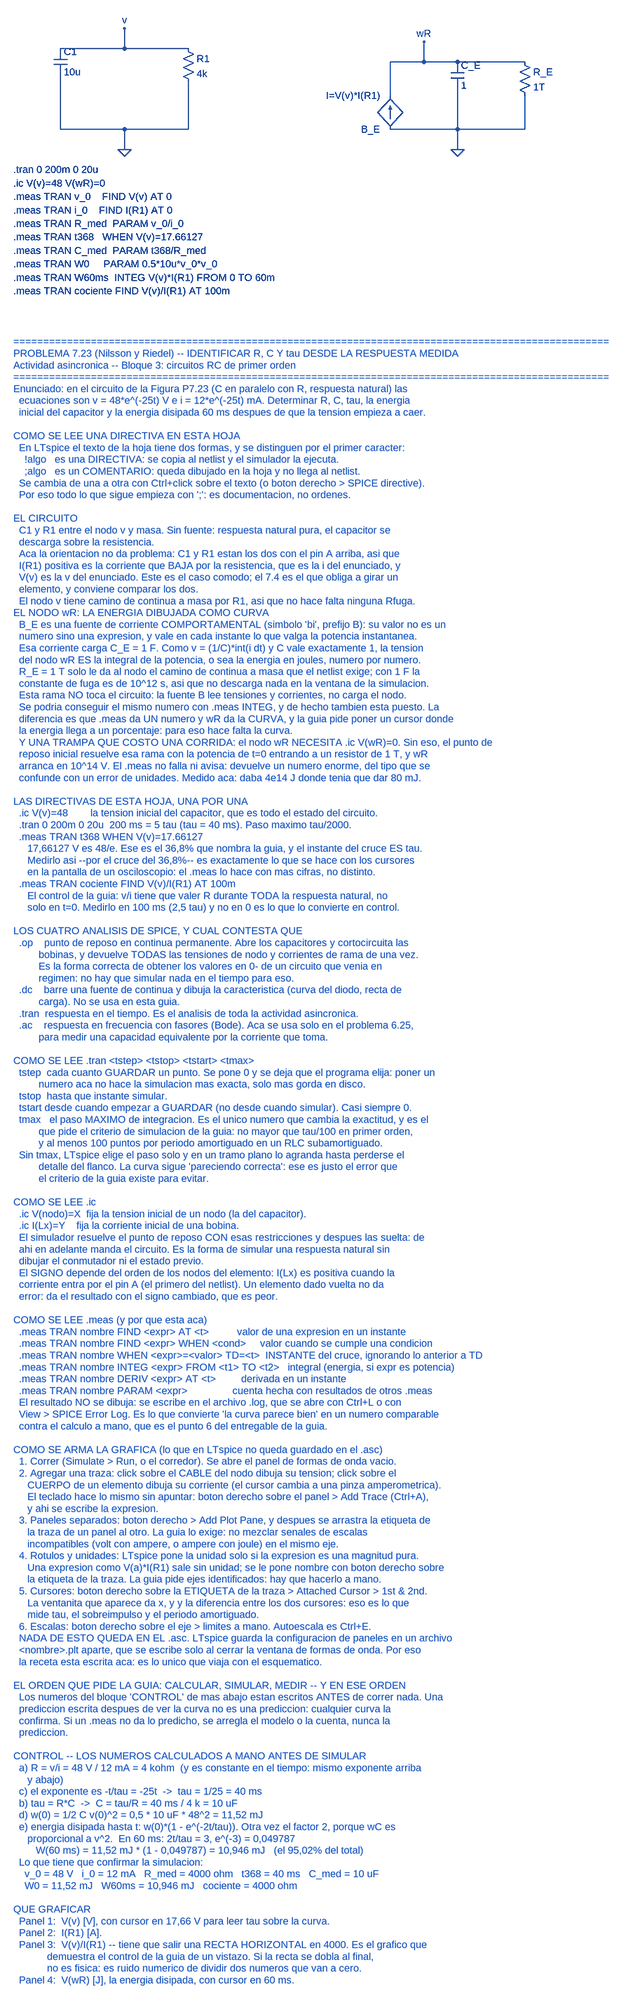
[diagram p0: schematic P7-23_RC_identificar_R_C_tau.asc]
P7-23_RC_identificar_R_C_tau.asc, the LTspice schematic file:
Version 4
SHEET 1 2200 2800
WIRE 176 176 176 304
WIRE 480 192 480 304
WIRE 176 112 480 112
WIRE 176 304 480 304
WIRE 328 304 328 352
WIRE 328 112 328 64
WIRE 960 224 960 144
WIRE 1120 208 1120 304
WIRE 1280 224 1280 304
WIRE 960 144 1280 144
WIRE 960 304 1280 304
WIRE 1120 304 1120 352
WIRE 1040 144 1040 96
FLAG 328 352 0
FLAG 328 64 v
FLAG 1120 352 0
FLAG 1040 96 wR
SYMBOL cap 160 112 R0
SYMATTR InstName C1
SYMATTR Value 10u
SYMBOL res 464 96 R0
SYMATTR InstName R1
SYMATTR Value 4k
SYMBOL bi 960 304 R180
WINDOW 123 0 0 Left 0
WINDOW 39 0 0 Left 0
SYMATTR InstName B_E
SYMATTR Value I=V(v)*I(R1)
SYMBOL cap 1104 144 R0
SYMATTR InstName C_E
SYMATTR Value 1
SYMBOL res 1264 128 R0
SYMATTR InstName R_E
SYMATTR Value 1T
TEXT 64 400 Left 2 !.tran 0 200m 0 20u
TEXT 64 432 Left 2 !.ic V(v)=48 V(wR)=0
TEXT 64 464 Left 2 !.meas TRAN v_0    FIND V(v) AT 0
TEXT 64 496 Left 2 !.meas TRAN i_0    FIND I(R1) AT 0
TEXT 64 528 Left 2 !.meas TRAN R_med  PARAM v_0/i_0
TEXT 64 560 Left 2 !.meas TRAN t368   WHEN V(v)=17.66127
TEXT 64 592 Left 2 !.meas TRAN C_med  PARAM t368/R_med
TEXT 64 624 Left 2 !.meas TRAN W0     PARAM 0.5*10u*v_0*v_0
TEXT 64 656 Left 2 !.meas TRAN W60ms  INTEG V(v)*I(R1) FROM 0 TO 60m
TEXT 64 688 Left 2 !.meas TRAN cociente FIND V(v)/I(R1) AT 100m
TEXT 64 900 Left 2 ;====================================================================================================
TEXT 64 928 Left 2 ;PROBLEMA 7.23 (Nilsson y Riedel) -- IDENTIFICAR R, C Y tau DESDE LA RESPUESTA MEDIDA
TEXT 64 956 Left 2 ;Actividad asincronica -- Bloque 3: circuitos RC de primer orden
TEXT 64 984 Left 2 ;====================================================================================================
TEXT 64 1012 Left 2 ;Enunciado: en el circuito de la Figura P7.23 (C en paralelo con R, respuesta natural) las
TEXT 64 1040 Left 2 ;  ecuaciones son v = 48*e^(-25t) V e i = 12*e^(-25t) mA. Determinar R, C, tau, la energia
TEXT 64 1068 Left 2 ;  inicial del capacitor y la energia disipada 60 ms despues de que la tension empieza a caer.
TEXT 64 1096 Left 2 ;
TEXT 64 1124 Left 2 ;COMO SE LEE UNA DIRECTIVA EN ESTA HOJA
TEXT 64 1152 Left 2 ;  En LTspice el texto de la hoja tiene dos formas, y se distinguen por el primer caracter:
TEXT 64 1180 Left 2 ;    !algo   es una DIRECTIVA: se copia al netlist y el simulador la ejecuta.
TEXT 64 1208 Left 2 ;    ;algo   es un COMENTARIO: queda dibujado en la hoja y no llega al netlist.
TEXT 64 1236 Left 2 ;  Se cambia de una a otra con Ctrl+click sobre el texto (o boton derecho > SPICE directive).
TEXT 64 1264 Left 2 ;  Por eso todo lo que sigue empieza con ';': es documentacion, no ordenes.
TEXT 64 1292 Left 2 ;
TEXT 64 1320 Left 2 ;EL CIRCUITO
TEXT 64 1348 Left 2 ;  C1 y R1 entre el nodo v y masa. Sin fuente: respuesta natural pura, el capacitor se
TEXT 64 1376 Left 2 ;  descarga sobre la resistencia.
TEXT 64 1404 Left 2 ;  Aca la orientacion no da problema: C1 y R1 estan los dos con el pin A arriba, asi que
TEXT 64 1432 Left 2 ;  I(R1) positiva es la corriente que BAJA por la resistencia, que es la i del enunciado, y
TEXT 64 1460 Left 2 ;  V(v) es la v del enunciado. Este es el caso comodo; el 7.4 es el que obliga a girar un
TEXT 64 1488 Left 2 ;  elemento, y conviene comparar los dos.
TEXT 64 1516 Left 2 ;  El nodo v tiene camino de continua a masa por R1, asi que no hace falta ninguna Rfuga.
TEXT 64 1544 Left 2 ;EL NODO wR: LA ENERGIA DIBUJADA COMO CURVA
TEXT 64 1572 Left 2 ;  B_E es una fuente de corriente COMPORTAMENTAL (simbolo 'bi', prefijo B): su valor no es un
TEXT 64 1600 Left 2 ;  numero sino una expresion, y vale en cada instante lo que valga la potencia instantanea.
TEXT 64 1628 Left 2 ;  Esa corriente carga C_E = 1 F. Como v = (1/C)*int(i dt) y C vale exactamente 1, la tension
TEXT 64 1656 Left 2 ;  del nodo wR ES la integral de la potencia, o sea la energia en joules, numero por numero.
TEXT 64 1684 Left 2 ;  R_E = 1 T solo le da al nodo el camino de continua a masa que el netlist exige; con 1 F la
TEXT 64 1712 Left 2 ;  constante de fuga es de 10^12 s, asi que no descarga nada en la ventana de la simulacion.
TEXT 64 1740 Left 2 ;  Esta rama NO toca el circuito: la fuente B lee tensiones y corrientes, no carga el nodo.
TEXT 64 1768 Left 2 ;  Se podria conseguir el mismo numero con .meas INTEG, y de hecho tambien esta puesto. La
TEXT 64 1796 Left 2 ;  diferencia es que .meas da UN numero y wR da la CURVA, y la guia pide poner un cursor donde
TEXT 64 1824 Left 2 ;  la energia llega a un porcentaje: para eso hace falta la curva.
TEXT 64 1852 Left 2 ;  Y UNA TRAMPA QUE COSTO UNA CORRIDA: el nodo wR NECESITA .ic V(wR)=0. Sin eso, el punto de
TEXT 64 1880 Left 2 ;  reposo inicial resuelve esa rama con la potencia de t=0 entrando a un resistor de 1 T, y wR
TEXT 64 1908 Left 2 ;  arranca en 10^14 V. El .meas no falla ni avisa: devuelve un numero enorme, del tipo que se
TEXT 64 1936 Left 2 ;  confunde con un error de unidades. Medido aca: daba 4e14 J donde tenia que dar 80 mJ.
TEXT 64 1964 Left 2 ;
TEXT 64 1992 Left 2 ;LAS DIRECTIVAS DE ESTA HOJA, UNA POR UNA
TEXT 64 2020 Left 2 ;  .ic V(v)=48        la tension inicial del capacitor, que es todo el estado del circuito.
TEXT 64 2048 Left 2 ;  .tran 0 200m 0 20u  200 ms = 5 tau (tau = 40 ms). Paso maximo tau/2000.
TEXT 64 2076 Left 2 ;  .meas TRAN t368 WHEN V(v)=17.66127
TEXT 64 2104 Left 2 ;     17,66127 V es 48/e. Ese es el 36,8% que nombra la guia, y el instante del cruce ES tau.
TEXT 64 2132 Left 2 ;     Medirlo asi --por el cruce del 36,8%-- es exactamente lo que se hace con los cursores
TEXT 64 2160 Left 2 ;     en la pantalla de un osciloscopio: el .meas lo hace con mas cifras, no distinto.
TEXT 64 2188 Left 2 ;  .meas TRAN cociente FIND V(v)/I(R1) AT 100m
TEXT 64 2216 Left 2 ;     El control de la guia: v/i tiene que valer R durante TODA la respuesta natural, no
TEXT 64 2244 Left 2 ;     solo en t=0. Medirlo en 100 ms (2,5 tau) y no en 0 es lo que lo convierte en control.
TEXT 64 2272 Left 2 ;
TEXT 64 2300 Left 2 ;LOS CUATRO ANALISIS DE SPICE, Y CUAL CONTESTA QUE
TEXT 64 2328 Left 2 ;  .op    punto de reposo en continua permanente. Abre los capacitores y cortocircuita las
TEXT 64 2356 Left 2 ;         bobinas, y devuelve TODAS las tensiones de nodo y corrientes de rama de una vez.
TEXT 64 2384 Left 2 ;         Es la forma correcta de obtener los valores en 0- de un circuito que venia en
TEXT 64 2412 Left 2 ;         regimen: no hay que simular nada en el tiempo para eso.
TEXT 64 2440 Left 2 ;  .dc    barre una fuente de continua y dibuja la caracteristica (curva del diodo, recta de
TEXT 64 2468 Left 2 ;         carga). No se usa en esta guia.
TEXT 64 2496 Left 2 ;  .tran  respuesta en el tiempo. Es el analisis de toda la actividad asincronica.
TEXT 64 2524 Left 2 ;  .ac    respuesta en frecuencia con fasores (Bode). Aca se usa solo en el problema 6.25,
TEXT 64 2552 Left 2 ;         para medir una capacidad equivalente por la corriente que toma.
TEXT 64 2580 Left 2 ;
TEXT 64 2608 Left 2 ;COMO SE LEE .tran <tstep> <tstop> <tstart> <tmax>
TEXT 64 2636 Left 2 ;  tstep  cada cuanto GUARDAR un punto. Se pone 0 y se deja que el programa elija: poner un
TEXT 64 2664 Left 2 ;         numero aca no hace la simulacion mas exacta, solo mas gorda en disco.
TEXT 64 2692 Left 2 ;  tstop  hasta que instante simular.
TEXT 64 2720 Left 2 ;  tstart desde cuando empezar a GUARDAR (no desde cuando simular). Casi siempre 0.
TEXT 64 2748 Left 2 ;  tmax   el paso MAXIMO de integracion. Es el unico numero que cambia la exactitud, y es el
TEXT 64 2776 Left 2 ;         que pide el criterio de simulacion de la guia: no mayor que tau/100 en primer orden,
TEXT 64 2804 Left 2 ;         y al menos 100 puntos por periodo amortiguado en un RLC subamortiguado.
TEXT 64 2832 Left 2 ;  Sin tmax, LTspice elige el paso solo y en un tramo plano lo agranda hasta perderse el
TEXT 64 2860 Left 2 ;         detalle del flanco. La curva sigue 'pareciendo correcta': ese es justo el error que
TEXT 64 2888 Left 2 ;         el criterio de la guia existe para evitar.
TEXT 64 2916 Left 2 ;
TEXT 64 2944 Left 2 ;COMO SE LEE .ic
TEXT 64 2972 Left 2 ;  .ic V(nodo)=X  fija la tension inicial de un nodo (la del capacitor).
TEXT 64 3000 Left 2 ;  .ic I(Lx)=Y    fija la corriente inicial de una bobina.
TEXT 64 3028 Left 2 ;  El simulador resuelve el punto de reposo CON esas restricciones y despues las suelta: de
TEXT 64 3056 Left 2 ;  ahi en adelante manda el circuito. Es la forma de simular una respuesta natural sin
TEXT 64 3084 Left 2 ;  dibujar el conmutador ni el estado previo.
TEXT 64 3112 Left 2 ;  El SIGNO depende del orden de los nodos del elemento: I(Lx) es positiva cuando la
TEXT 64 3140 Left 2 ;  corriente entra por el pin A (el primero del netlist). Un elemento dado vuelta no da
TEXT 64 3168 Left 2 ;  error: da el resultado con el signo cambiado, que es peor.
TEXT 64 3196 Left 2 ;
TEXT 64 3224 Left 2 ;COMO SE LEE .meas (y por que esta aca)
TEXT 64 3252 Left 2 ;  .meas TRAN nombre FIND <expr> AT <t>          valor de una expresion en un instante
TEXT 64 3280 Left 2 ;  .meas TRAN nombre FIND <expr> WHEN <cond>     valor cuando se cumple una condicion
TEXT 64 3308 Left 2 ;  .meas TRAN nombre WHEN <expr>=<valor> TD=<t>  INSTANTE del cruce, ignorando lo anterior a TD
TEXT 64 3336 Left 2 ;  .meas TRAN nombre INTEG <expr> FROM <t1> TO <t2>   integral (energia, si expr es potencia)
TEXT 64 3364 Left 2 ;  .meas TRAN nombre DERIV <expr> AT <t>         derivada en un instante
TEXT 64 3392 Left 2 ;  .meas TRAN nombre PARAM <expr>                cuenta hecha con resultados de otros .meas
TEXT 64 3420 Left 2 ;  El resultado NO se dibuja: se escribe en el archivo .log, que se abre con Ctrl+L o con
TEXT 64 3448 Left 2 ;  View > SPICE Error Log. Es lo que convierte 'la curva parece bien' en un numero comparable
TEXT 64 3476 Left 2 ;  contra el calculo a mano, que es el punto 6 del entregable de la guia.
TEXT 64 3504 Left 2 ;
TEXT 64 3532 Left 2 ;COMO SE ARMA LA GRAFICA (lo que en LTspice no queda guardado en el .asc)
TEXT 64 3560 Left 2 ;  1. Correr (Simulate > Run, o el corredor). Se abre el panel de formas de onda vacio.
TEXT 64 3588 Left 2 ;  2. Agregar una traza: click sobre el CABLE del nodo dibuja su tension; click sobre el
TEXT 64 3616 Left 2 ;     CUERPO de un elemento dibuja su corriente (el cursor cambia a una pinza amperometrica).
TEXT 64 3644 Left 2 ;     El teclado hace lo mismo sin apuntar: boton derecho sobre el panel > Add Trace (Ctrl+A),
TEXT 64 3672 Left 2 ;     y ahi se escribe la expresion.
TEXT 64 3700 Left 2 ;  3. Paneles separados: boton derecho > Add Plot Pane, y despues se arrastra la etiqueta de
TEXT 64 3728 Left 2 ;     la traza de un panel al otro. La guia lo exige: no mezclar senales de escalas
TEXT 64 3756 Left 2 ;     incompatibles (volt con ampere, o ampere con joule) en el mismo eje.
TEXT 64 3784 Left 2 ;  4. Rotulos y unidades: LTspice pone la unidad solo si la expresion es una magnitud pura.
TEXT 64 3812 Left 2 ;     Una expresion como V(a)*I(R1) sale sin unidad; se le pone nombre con boton derecho sobre
TEXT 64 3840 Left 2 ;     la etiqueta de la traza. La guia pide ejes identificados: hay que hacerlo a mano.
TEXT 64 3868 Left 2 ;  5. Cursores: boton derecho sobre la ETIQUETA de la traza > Attached Cursor > 1st & 2nd.
TEXT 64 3896 Left 2 ;     La ventanita que aparece da x, y y la diferencia entre los dos cursores: eso es lo que
TEXT 64 3924 Left 2 ;     mide tau, el sobreimpulso y el periodo amortiguado.
TEXT 64 3952 Left 2 ;  6. Escalas: boton derecho sobre el eje > limites a mano. Autoescala es Ctrl+E.
TEXT 64 3980 Left 2 ;  NADA DE ESTO QUEDA EN EL .asc. LTspice guarda la configuracion de paneles en un archivo
TEXT 64 4008 Left 2 ;  <nombre>.plt aparte, que se escribe solo al cerrar la ventana de formas de onda. Por eso
TEXT 64 4036 Left 2 ;  la receta esta escrita aca: es lo unico que viaja con el esquematico.
TEXT 64 4064 Left 2 ;
TEXT 64 4092 Left 2 ;EL ORDEN QUE PIDE LA GUIA: CALCULAR, SIMULAR, MEDIR -- Y EN ESE ORDEN
TEXT 64 4120 Left 2 ;  Los numeros del bloque 'CONTROL' de mas abajo estan escritos ANTES de correr nada. Una
TEXT 64 4148 Left 2 ;  prediccion escrita despues de ver la curva no es una prediccion: cualquier curva la
TEXT 64 4176 Left 2 ;  confirma. Si un .meas no da lo predicho, se arregla el modelo o la cuenta, nunca la
TEXT 64 4204 Left 2 ;  prediccion.
TEXT 64 4232 Left 2 ;
TEXT 64 4260 Left 2 ;CONTROL -- LOS NUMEROS CALCULADOS A MANO ANTES DE SIMULAR
TEXT 64 4288 Left 2 ;  a) R = v/i = 48 V / 12 mA = 4 kohm  (y es constante en el tiempo: mismo exponente arriba
TEXT 64 4316 Left 2 ;     y abajo)
TEXT 64 4344 Left 2 ;  c) el exponente es -t/tau = -25t  ->  tau = 1/25 = 40 ms
TEXT 64 4372 Left 2 ;  b) tau = R*C  ->  C = tau/R = 40 ms / 4 k = 10 uF
TEXT 64 4400 Left 2 ;  d) w(0) = 1/2 C v(0)^2 = 0,5 * 10 uF * 48^2 = 11,52 mJ
TEXT 64 4428 Left 2 ;  e) energia disipada hasta t: w(0)*(1 - e^(-2t/tau)). Otra vez el factor 2, porque wC es
TEXT 64 4456 Left 2 ;     proporcional a v^2.  En 60 ms: 2t/tau = 3, e^(-3) = 0,049787
TEXT 64 4484 Left 2 ;        W(60 ms) = 11,52 mJ * (1 - 0,049787) = 10,946 mJ   (el 95,02% del total)
TEXT 64 4512 Left 2 ;  Lo que tiene que confirmar la simulacion:
TEXT 64 4540 Left 2 ;    v_0 = 48 V   i_0 = 12 mA   R_med = 4000 ohm   t368 = 40 ms   C_med = 10 uF
TEXT 64 4568 Left 2 ;    W0 = 11,52 mJ   W60ms = 10,946 mJ   cociente = 4000 ohm
TEXT 64 4596 Left 2 ;
TEXT 64 4624 Left 2 ;QUE GRAFICAR
TEXT 64 4652 Left 2 ;  Panel 1:  V(v) [V], con cursor en 17,66 V para leer tau sobre la curva.
TEXT 64 4680 Left 2 ;  Panel 2:  I(R1) [A].
TEXT 64 4708 Left 2 ;  Panel 3:  V(v)/I(R1) -- tiene que salir una RECTA HORIZONTAL en 4000. Es el grafico que
TEXT 64 4736 Left 2 ;            demuestra el control de la guia de un vistazo. Si la recta se dobla al final,
TEXT 64 4764 Left 2 ;            no es fisica: es ruido numerico de dividir dos numeros que van a cero.
TEXT 64 4792 Left 2 ;  Panel 4:  V(wR) [J], la energia disipada, con cursor en 60 ms.

The netlist it stands for:
* P7-23_RC_identificar_R_C_tau.asc
C1 v 0 10u
R1 v 0 4k
B_E 0 wR I=V(v)*I(R1)
C_E wR 0 1
R_E wR 0 1T
.tran 0 200m 0 20u
.ic V(v)=48 V(wR)=0
.meas TRAN v_0    FIND V(v) AT 0
.meas TRAN i_0    FIND I(R1) AT 0
.meas TRAN R_med  PARAM v_0/i_0
.meas TRAN t368   WHEN V(v)=17.66127
.meas TRAN C_med  PARAM t368/R_med
.meas TRAN W0     PARAM 0.5*10u*v_0*v_0
.meas TRAN W60ms  INTEG V(v)*I(R1) FROM 0 TO 60m
.meas TRAN cociente FIND V(v)/I(R1) AT 100m
* ====================================================================================================
* PROBLEMA 7.23 (Nilsson y Riedel) -- IDENTIFICAR R, C Y tau DESDE LA RESPUESTA MEDIDA
* Actividad asincronica -- Bloque 3: circuitos RC de primer orden
* ====================================================================================================
* Enunciado: en el circuito de la Figura P7.23 (C en paralelo con R, respuesta natural) las
*   ecuaciones son v = 48*e^(-25t) V e i = 12*e^(-25t) mA. Determinar R, C, tau, la energia
*   inicial del capacitor y la energia disipada 60 ms despues de que la tension empieza a caer.
* COMO SE LEE UNA DIRECTIVA EN ESTA HOJA
*   En LTspice el texto de la hoja tiene dos formas, y se distinguen por el primer caracter:
*     !algo   es una DIRECTIVA: se copia al netlist y el simulador la ejecuta.
*     ;algo   es un COMENTARIO: queda dibujado en la hoja y no llega al netlist.
*   Se cambia de una a otra con Ctrl+click sobre el texto (o boton derecho > SPICE directive).
*   Por eso todo lo que sigue empieza con ';': es documentacion, no ordenes.
* EL CIRCUITO
*   C1 y R1 entre el nodo v y masa. Sin fuente: respuesta natural pura, el capacitor se
*   descarga sobre la resistencia.
*   Aca la orientacion no da problema: C1 y R1 estan los dos con el pin A arriba, asi que
*   I(R1) positiva es la corriente que BAJA por la resistencia, que es la i del enunciado, y
*   V(v) es la v del enunciado. Este es el caso comodo; el 7.4 es el que obliga a girar un
*   elemento, y conviene comparar los dos.
*   El nodo v tiene camino de continua a masa por R1, asi que no hace falta ninguna Rfuga.
* EL NODO wR: LA ENERGIA DIBUJADA COMO CURVA
*   B_E es una fuente de corriente COMPORTAMENTAL (simbolo 'bi', prefijo B): su valor no es un
*   numero sino una expresion, y vale en cada instante lo que valga la potencia instantanea.
*   Esa corriente carga C_E = 1 F. Como v = (1/C)*int(i dt) y C vale exactamente 1, la tension
*   del nodo wR ES la integral de la potencia, o sea la energia en joules, numero por numero.
*   R_E = 1 T solo le da al nodo el camino de continua a masa que el netlist exige; con 1 F la
*   constante de fuga es de 10^12 s, asi que no descarga nada en la ventana de la simulacion.
*   Esta rama NO toca el circuito: la fuente B lee tensiones y corrientes, no carga el nodo.
*   Se podria conseguir el mismo numero con .meas INTEG, y de hecho tambien esta puesto. La
*   diferencia es que .meas da UN numero y wR da la CURVA, y la guia pide poner un cursor donde
*   la energia llega a un porcentaje: para eso hace falta la curva.
*   Y UNA TRAMPA QUE COSTO UNA CORRIDA: el nodo wR NECESITA .ic V(wR)=0. Sin eso, el punto de
*   reposo inicial resuelve esa rama con la potencia de t=0 entrando a un resistor de 1 T, y wR
*   arranca en 10^14 V. El .meas no falla ni avisa: devuelve un numero enorme, del tipo que se
*   confunde con un error de unidades. Medido aca: daba 4e14 J donde tenia que dar 80 mJ.
* LAS DIRECTIVAS DE ESTA HOJA, UNA POR UNA
*   .ic V(v)=48        la tension inicial del capacitor, que es todo el estado del circuito.
*   .tran 0 200m 0 20u  200 ms = 5 tau (tau = 40 ms). Paso maximo tau/2000.
*   .meas TRAN t368 WHEN V(v)=17.66127
*      17,66127 V es 48/e. Ese es el 36,8% que nombra la guia, y el instante del cruce ES tau.
*      Medirlo asi --por el cruce del 36,8%-- es exactamente lo que se hace con los cursores
*      en la pantalla de un osciloscopio: el .meas lo hace con mas cifras, no distinto.
*   .meas TRAN cociente FIND V(v)/I(R1) AT 100m
*      El control de la guia: v/i tiene que valer R durante TODA la respuesta natural, no
*      solo en t=0. Medirlo en 100 ms (2,5 tau) y no en 0 es lo que lo convierte en control.
* LOS CUATRO ANALISIS DE SPICE, Y CUAL CONTESTA QUE
*   .op    punto de reposo en continua permanente. Abre los capacitores y cortocircuita las
*          bobinas, y devuelve TODAS las tensiones de nodo y corrientes de rama de una vez.
*          Es la forma correcta de obtener los valores en 0- de un circuito que venia en
*          regimen: no hay que simular nada en el tiempo para eso.
*   .dc    barre una fuente de continua y dibuja la caracteristica (curva del diodo, recta de
*          carga). No se usa en esta guia.
*   .tran  respuesta en el tiempo. Es el analisis de toda la actividad asincronica.
*   .ac    respuesta en frecuencia con fasores (Bode). Aca se usa solo en el problema 6.25,
*          para medir una capacidad equivalente por la corriente que toma.
* COMO SE LEE .tran <tstep> <tstop> <tstart> <tmax>
*   tstep  cada cuanto GUARDAR un punto. Se pone 0 y se deja que el programa elija: poner un
*          numero aca no hace la simulacion mas exacta, solo mas gorda en disco.
*   tstop  hasta que instante simular.
*   tstart desde cuando empezar a GUARDAR (no desde cuando simular). Casi siempre 0.
*   tmax   el paso MAXIMO de integracion. Es el unico numero que cambia la exactitud, y es el
*          que pide el criterio de simulacion de la guia: no mayor que tau/100 en primer orden,
*          y al menos 100 puntos por periodo amortiguado en un RLC subamortiguado.
*   Sin tmax, LTspice elige el paso solo y en un tramo plano lo agranda hasta perderse el
*          detalle del flanco. La curva sigue 'pareciendo correcta': ese es justo el error que
*          el criterio de la guia existe para evitar.
* COMO SE LEE .ic
*   .ic V(nodo)=X  fija la tension inicial de un nodo (la del capacitor).
*   .ic I(Lx)=Y    fija la corriente inicial de una bobina.
*   El simulador resuelve el punto de reposo CON esas restricciones y despues las suelta: de
*   ahi en adelante manda el circuito. Es la forma de simular una respuesta natural sin
*   dibujar el conmutador ni el estado previo.
*   El SIGNO depende del orden de los nodos del elemento: I(Lx) es positiva cuando la
*   corriente entra por el pin A (el primero del netlist). Un elemento dado vuelta no da
*   error: da el resultado con el signo cambiado, que es peor.
* COMO SE LEE .meas (y por que esta aca)
*   .meas TRAN nombre FIND <expr> AT <t>          valor de una expresion en un instante
*   .meas TRAN nombre FIND <expr> WHEN <cond>     valor cuando se cumple una condicion
*   .meas TRAN nombre WHEN <expr>=<valor> TD=<t>  INSTANTE del cruce, ignorando lo anterior a TD
*   .meas TRAN nombre INTEG <expr> FROM <t1> TO <t2>   integral (energia, si expr es potencia)
*   .meas TRAN nombre DERIV <expr> AT <t>         derivada en un instante
*   .meas TRAN nombre PARAM <expr>                cuenta hecha con resultados de otros .meas
*   El resultado NO se dibuja: se escribe en el archivo .log, que se abre con Ctrl+L o con
*   View > SPICE Error Log. Es lo que convierte 'la curva parece bien' en un numero comparable
*   contra el calculo a mano, que es el punto 6 del entregable de la guia.
* COMO SE ARMA LA GRAFICA (lo que en LTspice no queda guardado en el .asc)
*   1. Correr (Simulate > Run, o el corredor). Se abre el panel de formas de onda vacio.
*   2. Agregar una traza: click sobre el CABLE del nodo dibuja su tension; click sobre el
*      CUERPO de un elemento dibuja su corriente (el cursor cambia a una pinza amperometrica).
*      El teclado hace lo mismo sin apuntar: boton derecho sobre el panel > Add Trace (Ctrl+A),
*      y ahi se escribe la expresion.
*   3. Paneles separados: boton derecho > Add Plot Pane, y despues se arrastra la etiqueta de
*      la traza de un panel al otro. La guia lo exige: no mezclar senales de escalas
*      incompatibles (volt con ampere, o ampere con joule) en el mismo eje.
*   4. Rotulos y unidades: LTspice pone la unidad solo si la expresion es una magnitud pura.
*      Una expresion como V(a)*I(R1) sale sin unidad; se le pone nombre con boton derecho sobre
*      la etiqueta de la traza. La guia pide ejes identificados: hay que hacerlo a mano.
*   5. Cursores: boton derecho sobre la ETIQUETA de la traza > Attached Cursor > 1st & 2nd.
*      La ventanita que aparece da x, y y la diferencia entre los dos cursores: eso es lo que
*      mide tau, el sobreimpulso y el periodo amortiguado.
*   6. Escalas: boton derecho sobre el eje > limites a mano. Autoescala es Ctrl+E.
*   NADA DE ESTO QUEDA EN EL .asc. LTspice guarda la configuracion de paneles en un archivo
*   <nombre>.plt aparte, que se escribe solo al cerrar la ventana de formas de onda. Por eso
*   la receta esta escrita aca: es lo unico que viaja con el esquematico.
* EL ORDEN QUE PIDE LA GUIA: CALCULAR, SIMULAR, MEDIR -- Y EN ESE ORDEN
*   Los numeros del bloque 'CONTROL' de mas abajo estan escritos ANTES de correr nada. Una
*   prediccion escrita despues de ver la curva no es una prediccion: cualquier curva la
*   confirma. Si un .meas no da lo predicho, se arregla el modelo o la cuenta, nunca la
*   prediccion.
* CONTROL -- LOS NUMEROS CALCULADOS A MANO ANTES DE SIMULAR
*   a) R = v/i = 48 V / 12 mA = 4 kohm  (y es constante en el tiempo: mismo exponente arriba
*      y abajo)
*   c) el exponente es -t/tau = -25t  ->  tau = 1/25 = 40 ms
*   b) tau = R*C  ->  C = tau/R = 40 ms / 4 k = 10 uF
*   d) w(0) = 1/2 C v(0)^2 = 0,5 * 10 uF * 48^2 = 11,52 mJ
*   e) energia disipada hasta t: w(0)*(1 - e^(-2t/tau)). Otra vez el factor 2, porque wC es
*      proporcional a v^2.  En 60 ms: 2t/tau = 3, e^(-3) = 0,049787
*         W(60 ms) = 11,52 mJ * (1 - 0,049787) = 10,946 mJ   (el 95,02% del total)
*   Lo que tiene que confirmar la simulacion:
*     v_0 = 48 V   i_0 = 12 mA   R_med = 4000 ohm   t368 = 40 ms   C_med = 10 uF
*     W0 = 11,52 mJ   W60ms = 10,946 mJ   cociente = 4000 ohm
* QUE GRAFICAR
*   Panel 1:  V(v) [V], con cursor en 17,66 V para leer tau sobre la curva.
*   Panel 2:  I(R1) [A].
*   Panel 3:  V(v)/I(R1) -- tiene que salir una RECTA HORIZONTAL en 4000. Es el grafico que
*             demuestra el control de la guia de un vistazo. Si la recta se dobla al final,
*             no es fisica: es ruido numerico de dividir dos numeros que van a cero.
*   Panel 4:  V(wR) [J], la energia disipada, con cursor en 60 ms.
.backanno
.end